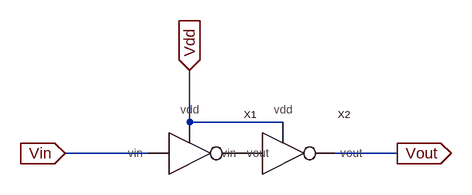
[diagram p0: schematic s_buf.asc]
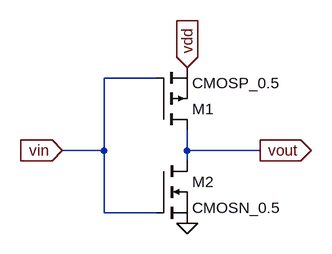
[diagram p1: sub-circuit s_inv.asc]
s_buf.asc, the LTspice schematic file:
Version 4
SHEET 1 880 680
WIRE 144 112 144 32
WIRE 288 112 144 112
WIRE 80 160 -48 160
WIRE 464 160 368 160
FLAG -48 160 Vin
IOPIN -48 160 In
FLAG 144 32 Vdd
IOPIN 144 32 In
FLAG 464 160 Vout
IOPIN 464 160 Out
SYMBOL s_inv 144 160 R0
SYMATTR InstName X1
SYMBOL s_inv 288 160 R0
SYMATTR InstName X2

s_inv.asc, the sub-circuit schematic file:
Version 4
SHEET 1 880 680
WIRE 128 -112 48 -112
WIRE 48 0 48 -112
WIRE 48 0 -16 0
WIRE 176 0 176 -32
WIRE 288 0 176 0
WIRE 176 16 176 0
WIRE 48 96 48 0
WIRE 128 96 48 96
FLAG 288 0 vout
IOPIN 288 0 Out
FLAG -16 0 vin
IOPIN -16 0 In
FLAG 176 -128 vdd
IOPIN 176 -128 In
FLAG 176 112 0
SYMBOL pmos 128 -32 M180
SYMATTR InstName M1
SYMATTR Value CMOSP_0.5
SYMBOL nmos 128 16 R0
SYMATTR InstName M2
SYMATTR Value CMOSN_0.5

The netlist it stands for:
* s_buf.asc
XX1 Vin P001 Vdd s_inv
XX2 P001 Vout Vdd s_inv

* block symbol definitions
.subckt s_inv vin vout vdd
M1 vout vin vdd vdd CMOSP_0.5
M2 vout vin 0 0 CMOSN_0.5
.ends s_inv

.model NMOS NMOS
.model PMOS PMOS
.lib standard.mos
.backanno
.end